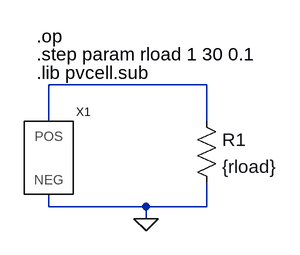
[diagram p0: schematic pvsweep.asc]
pvsweep.asc, the LTspice schematic file:
Version 4
SHEET 1 880 680
WIRE 288 48 80 48
WIRE 80 96 80 48
WIRE 288 96 288 48
WIRE 80 208 80 192
WIRE 208 208 80 208
WIRE 288 208 288 176
WIRE 288 208 208 208
WIRE 208 224 208 208
FLAG 208 224 0
SYMBOL pvcell 80 144 R0
SYMATTR InstName X1
SYMBOL res 272 80 R0
SYMATTR InstName R1
SYMATTR Value {rload}
TEXT 64 -16 Left 2 !.op
TEXT 64 8 Left 2 !.step param rload 1 30 0.1
TEXT 64 32 Left 2 !.lib pvcell.sub

The netlist it stands for:
* pvsweep.asc
XX1 0 N001 pvcell  ; pins NEG POS
R1 N001 0 {rload}
.op
.step param rload 1 30 0.1
.lib pvcell.sub
.backanno
.end